# Altium schematic sheet Сборочный.SchDoc
size 594 x 420 mm; Address1: Address1; Address2: Address2; Address3: Address3; Address4: Address4; SheetNumber: 1; Scale: 1:1; Разраб.: Павловская В.А.; Пров.: Смолин В.А.; Номер листа: 1; Общее количество листов: 1; Масштаб: 4:1; Наименование изделия 1: Цифровой автомат; Наименование изделия 2: Сборочный чертеж; Нач. отд.: Нач. отд.
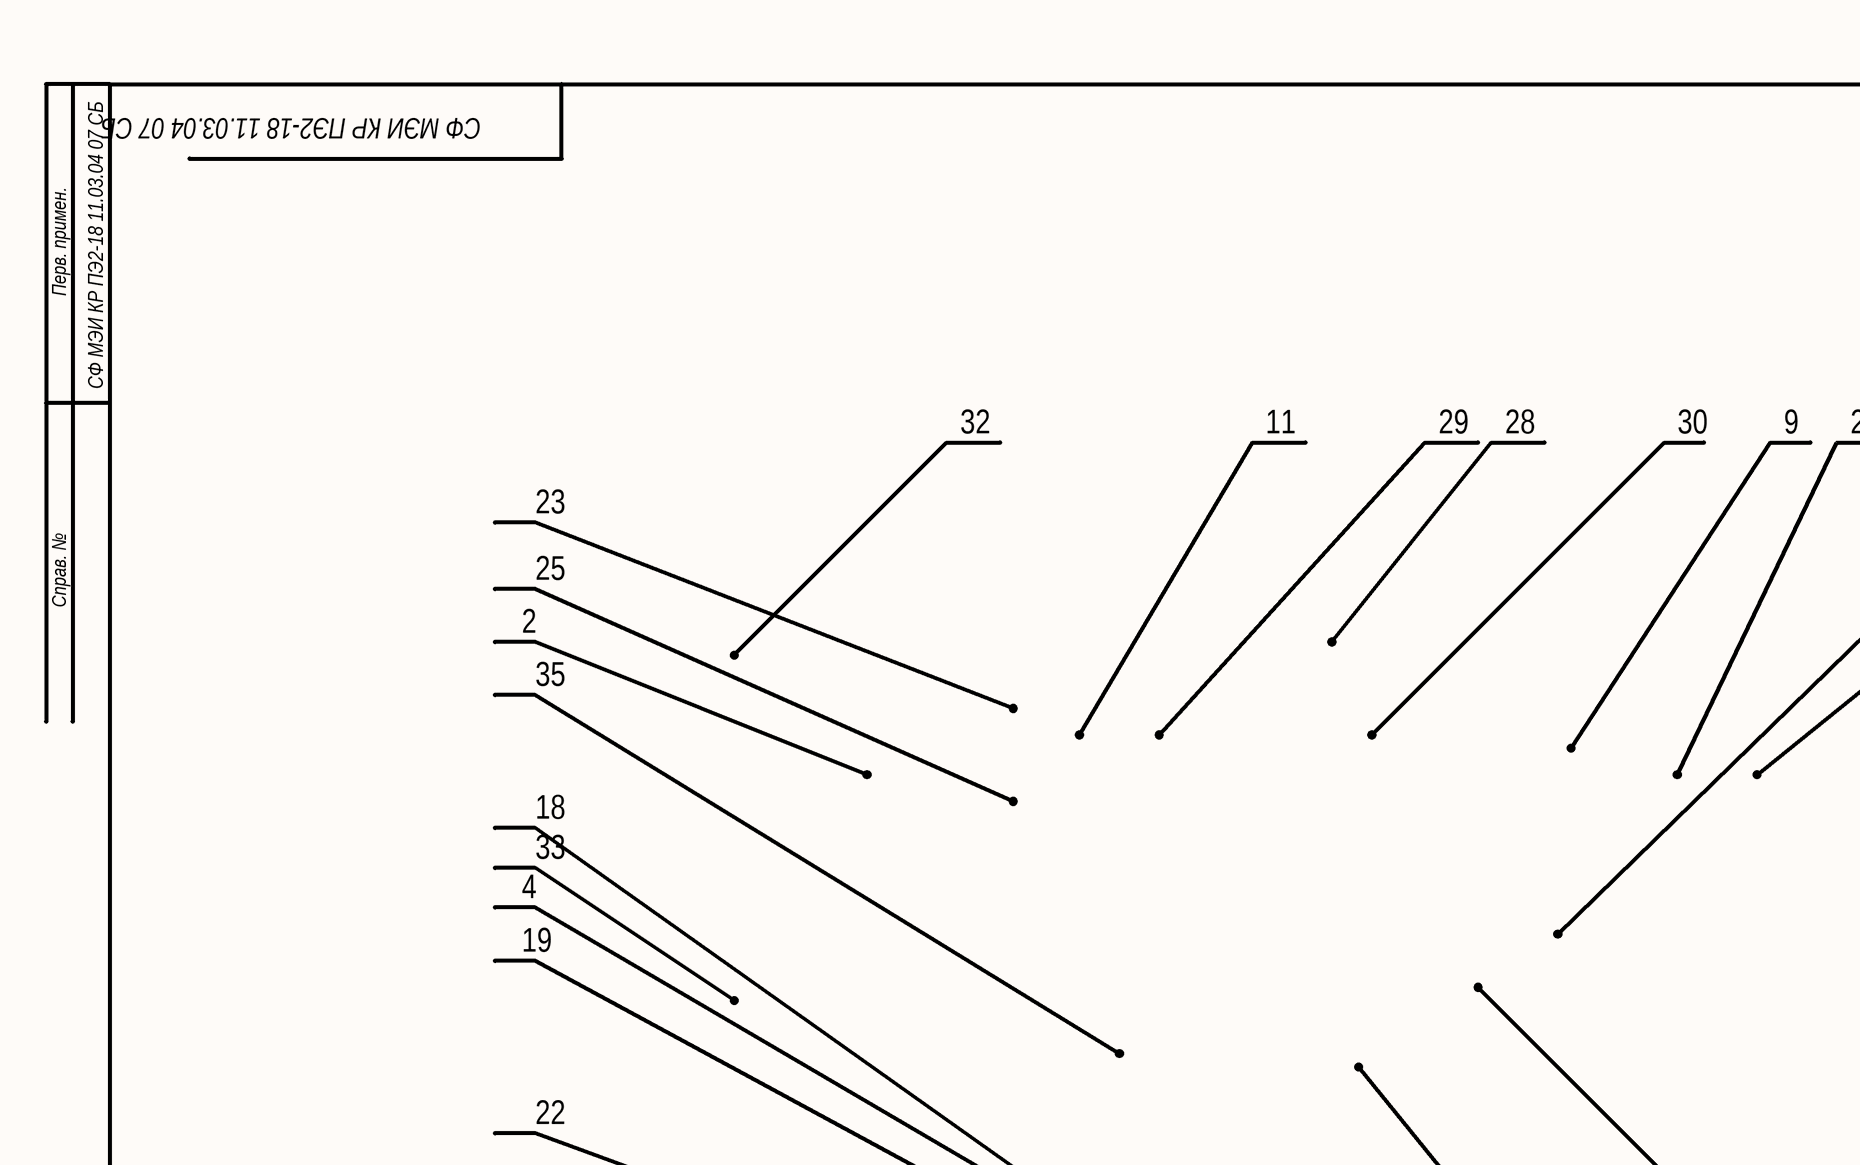
[diagram p0: Сборочный.SchDoc, top left]
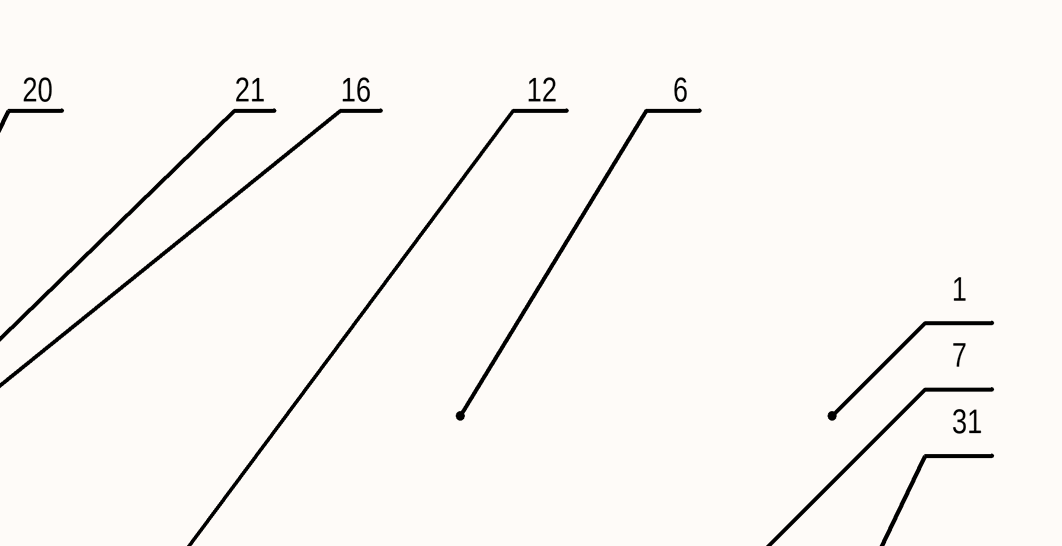
[diagram p1: Сборочный.SchDoc, top right]
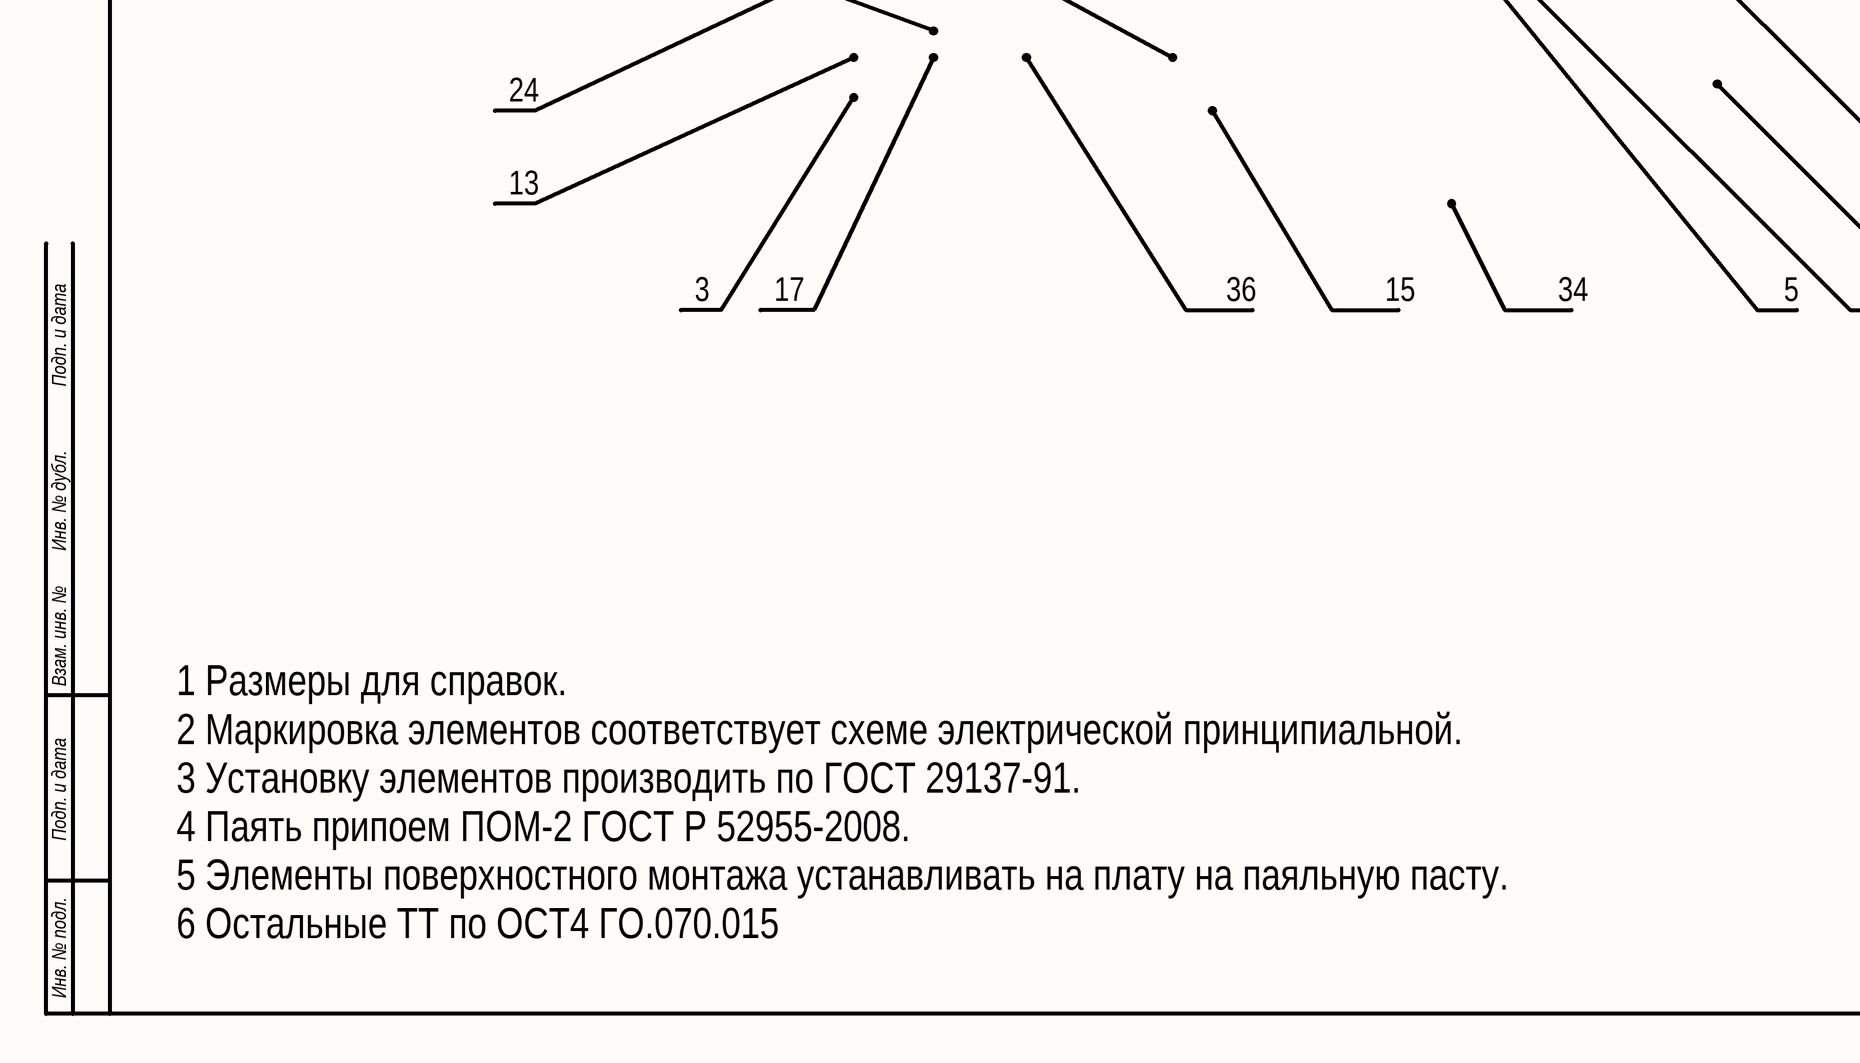
[diagram p2: Сборочный.SchDoc, bottom left]
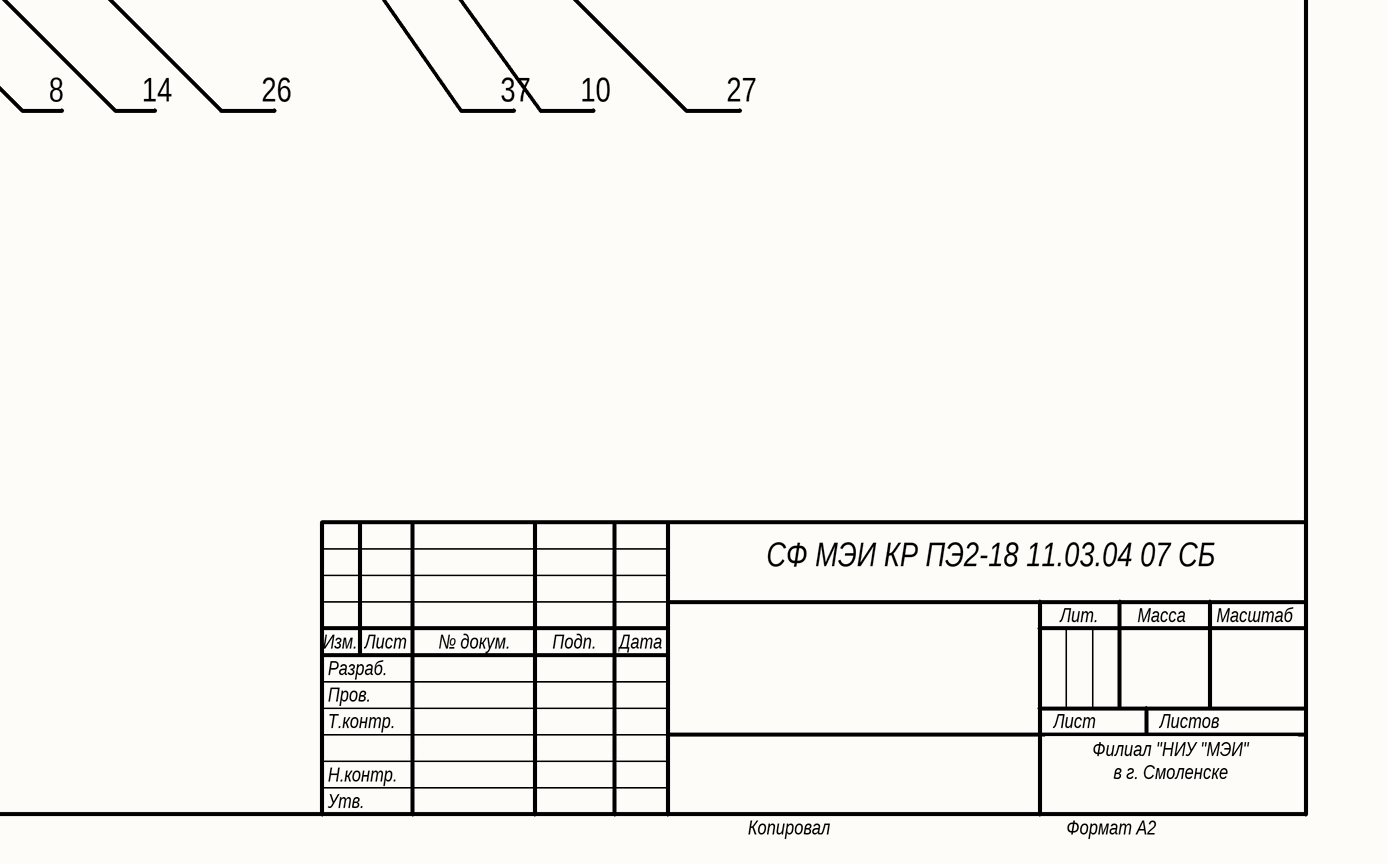
[diagram p3: Сборочный.SchDoc, bottom right]

## Notes on the sheet
- СФ МЭИ КР ПЭ2-18 11.03.04 07 СБ
- Перв. примен.
- 32
- 11
- 29
- 28
- 30
- 9
- 20
- 21
- 16
- 12
- 6
- 23
- Справ. №
- 25
- 2
- 35
- 1
- 7
- 18
- 31
- 33
- 4
- 19
- 22
- 24
- 13
- 3
- 17
- 36
- 15
- 34
- 5
- 8
- 14
- 26
- 37
- 10
- 27
- Подп. и дата
- Инв. № дубл.
- Взам. инв. №
- Разраб.
- Изм.
- Лист
- № докум.
- Подп.
- Дата
- Лит.
- Масса
- Масштаб
- Пров.
- Т.контр.
- Листов
- Инв. № подл.
- 1 Размеры для справок.
  2 Маркировка элементов соответствует схеме электрической принципиальной.
  3 Установку элементов производить по ГОСТ 29137-91.
  4 Паять припоем ПОМ-2 ГОСТ Р 52955-2008.
  5 Элементы поверхностного монтажа устанавливать на плату на паяльную пасту.
  6 Остальные ТТ по ОСТ4 ГО.070.015
- Утв.
- Н.контр.
- Филиал "НИУ "МЭИ"
  в г. Смоленске
  ПЭ2-18
- Копировал
- Формат А2